# EAGLE design devboard (EAGLE 9.6.2)
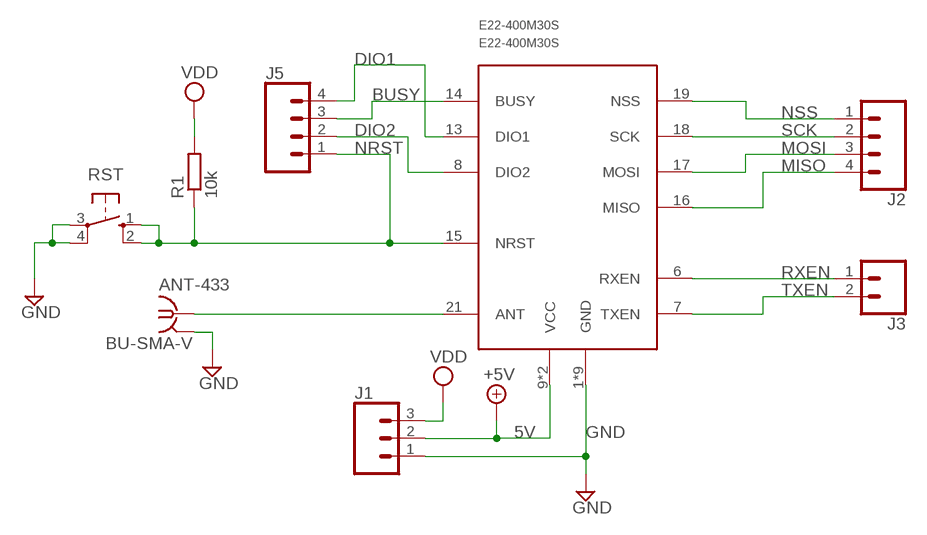
[diagram p0: schematic, sheet 1]

## Parts
ANT-433  BU-SMA-V  [BU-SMA-V]
E22-400M30S  E22-400M30S  [E22-400M30S]
J1  CONN_03LOCK_LONGPADS  [1X03_LOCK_LONGPADS]
J2  CONN_04LOCK_LONGPADS  [1X04_LOCK_LONGPADS]
J3  CONN_02PTH3  [1X02_LONGPADS]
J5  CONN_04LOCK_LONGPADS  [1X04_LOCK_LONGPADS]
R1  10k  R-EU_R0603  [R0603]
RST  10-XX  [B3F-10XX]

## Nets
5V: E22-400M30S.9(VCC) E22-400M30S.10(VCC) J1.2 ; supply symbol labelled +5V
ANT [rf433]: ANT-433.1 E22-400M30S.21(ANT)
BUSY: E22-400M30S.14(BUSY) J5.3
DIO1: E22-400M30S.13(DIO1) J5.4
DIO2: E22-400M30S.8(DIO2) J5.2
GND: ANT-433.2 ANT-433.3 ANT-433.4 ANT-433.5 E22-400M30S.1(GND) E22-400M30S.2(GND) E22-400M30S.3(GND) E22-400M30S.4(GND) E22-400M30S.5(GND) E22-400M30S.11(GND) E22-400M30S.12(GND) E22-400M30S.20(GND) E22-400M30S.22(GND) J1.1 RST.3(P) RST.4(P1)
MISO: E22-400M30S.16(MISO) J2.4
MOSI: E22-400M30S.17(MOSI) J2.3
NRST: E22-400M30S.15(NRST) J5.1 R1.1 RST.1(S) RST.2(S1)
NSS: E22-400M30S.19(NSS) J2.1
RXEN: E22-400M30S.6(RXEN) J3.1
SCK: E22-400M30S.18(SCK) J2.2
TXEN: E22-400M30S.7(TXEN) J3.2
VDD: J1.3 R1.2

## Library data of the parts
ANT-433 = conn-coax-no-thermals:BU-SMA-V: FEMALE SMA CONNECTOR Radiall distributor RS 112-3794; OC_FARNELL: unknown; OC_NEWARK: unknown
E22-400M30S = ebyte-radio:E22-400M30S: EBYTE E22400M30S radio module Datasheet and info: http://www.ebyte.com/en/product-view-news.aspx?id=454
J1 = SparkFun-Connectors:CONN_03: Multi connection point. Often used as Generic Header-pin footprint for 0.1 inch spaced/style header connections On any of the 0.1 inch spaced packages, you can populate with these: Break Away Headers - Straight <https://www.sparkfun.com/products/116> (PRT-00116) Break Away Male Headers - Right Angle <https://www.sparkfun.com/products/553> (PRT-00553) Female Headers <https://www.sparkfun.com/products/115> (PRT-00115) Break Away Headers - Machine Pin <https://www.sparkfun.com/products/117> (PRT-00117) Break Away Female Headers - Swiss Machine Pin <https://www.sparkfun.com/products/743> (PRT-00743) Stackable Header - 3 Pin (Female, 0.1") <https://www.sparkfun.com/products/13875> (PRT-13875) For SCREWTERMINALS and SPRING TERMINALS visit here: Screw Terimnals on SparkFun.com <https://www.sparkfun.com/search/results?term=Screw+Terminals> (5mm/3.5mm/2.54mm spacing) This device is also useful as a general connection point to wire up your design to another part of your project. Our various solder wires solder well into these plated through hole pads. Hook-Up Wire - Assortment (Stranded, 22 AWG) <https://www.sparkfun.com/products/11375> (PRT-11375) Hook-Up Wire - Assortment (Solid Core, 22 AWG) <https://www.sparkfun.com/products/11367> (PRT-11367) View the entire wire category on our website here <https://www.sparkfun.com/categories/141> Special notes: Molex polarized connector foot print use with SKU : PRT-08232 with associated crimp pins and housings.
J2 J5 = SparkFun-Connectors:CONN_04: Multi connection point. Often used as Generic Header-pin footprint for 0.1 inch spaced/style header connections On any of the 0.1 inch spaced packages, you can populate with these: Break Away Headers - Straight <https://www.sparkfun.com/products/116> (PRT-00116) Break Away Male Headers - Right Angle <https://www.sparkfun.com/products/553> (PRT-00553) Female Headers <https://www.sparkfun.com/products/115> (PRT-00115) Break Away Headers - Machine Pin <https://www.sparkfun.com/products/117> (PRT-00117) Break Away Female Headers - Swiss Machine Pin <https://www.sparkfun.com/products/743> (PRT-00743) For SCREWTERMINALS and SPRING TERMINALS visit here: Screw Terimnals on SparkFun.com <https://www.sparkfun.com/search/results?term=Screw+Terminals> (5mm/3.5mm/2.54mm spacing) This device is also useful as a general connection point to wire up your design to another part of your project. Our various solder wires solder well into these plated through hole pads. Hook-Up Wire - Assortment (Stranded, 22 AWG) <https://www.sparkfun.com/products/11375> (PRT-11375) Hook-Up Wire - Assortment (Solid Core, 22 AWG) <https://www.sparkfun.com/products/11367> (PRT-11367) View the entire wire category on our website here <https://www.sparkfun.com/categories/141> Special notes: Molex polarized connector foot print use with SKU : PRT-08231 with associated crimp pins and housings. 1MM SMD Version SKU: PRT-10208; PROD_ID: CONN-09696
J3 = SparkFun-Connectors:CONN_02: Multi connection point. Often used as Generic Header-pin footprint for 0.1 inch spaced/style header connections On any of the 0.1 inch spaced packages, you can populate with these: Break Away Headers - Straight <https://www.sparkfun.com/products/116> (PRT-00116) Break Away Male Headers - Right Angle <https://www.sparkfun.com/products/553> (PRT-00553) Female Headers <https://www.sparkfun.com/products/115> (PRT-00115) Break Away Headers - Machine Pin <https://www.sparkfun.com/products/117> (PRT-00117) Break Away Female Headers - Swiss Machine Pin <https://www.sparkfun.com/products/743> (PRT-00743) For SCREWTERMINALS and SPRING TERMINALS visit here: Screw Terimnals on SparkFun.com <https://www.sparkfun.com/search/results?term=Screw+Terminals> (5mm/3.5mm/2.54mm spacing) This device is also useful as a general connection point to wire up your design to another part of your project. Our various solder wires solder well into these plated through hole pads. Hook-Up Wire - Assortment (Stranded, 22 AWG) <https://www.sparkfun.com/products/11375> (PRT-11375) Hook-Up Wire - Assortment (Solid Core, 22 AWG) <https://www.sparkfun.com/products/11367> (PRT-11367) View the entire wire category on our website here <https://www.sparkfun.com/categories/141> Special notes: Molex polarized connector foot print use with: PRT-08233 with associated crimp pins and housings. 2.54_SCREWTERM for use with PRT-10571. 3.5mm Screw Terminal footprints for PRT-08084 5mm Screw Terminal footprints for use with PRT-08432
R1 = rcl:R-EU_: RESISTOR, European symbol; SPICEPREFIX: R
RST = switch-omron:10-XX: OMRON SWITCH; MPN: B3F-1000; OC_FARNELL: 176432; OC_NEWARK: 36M3542

## Net classes
0 default: clearance 0.3 mm
1 rf433: clearance 0.2 mm to class 0, clearance 0.2 mm

## Board
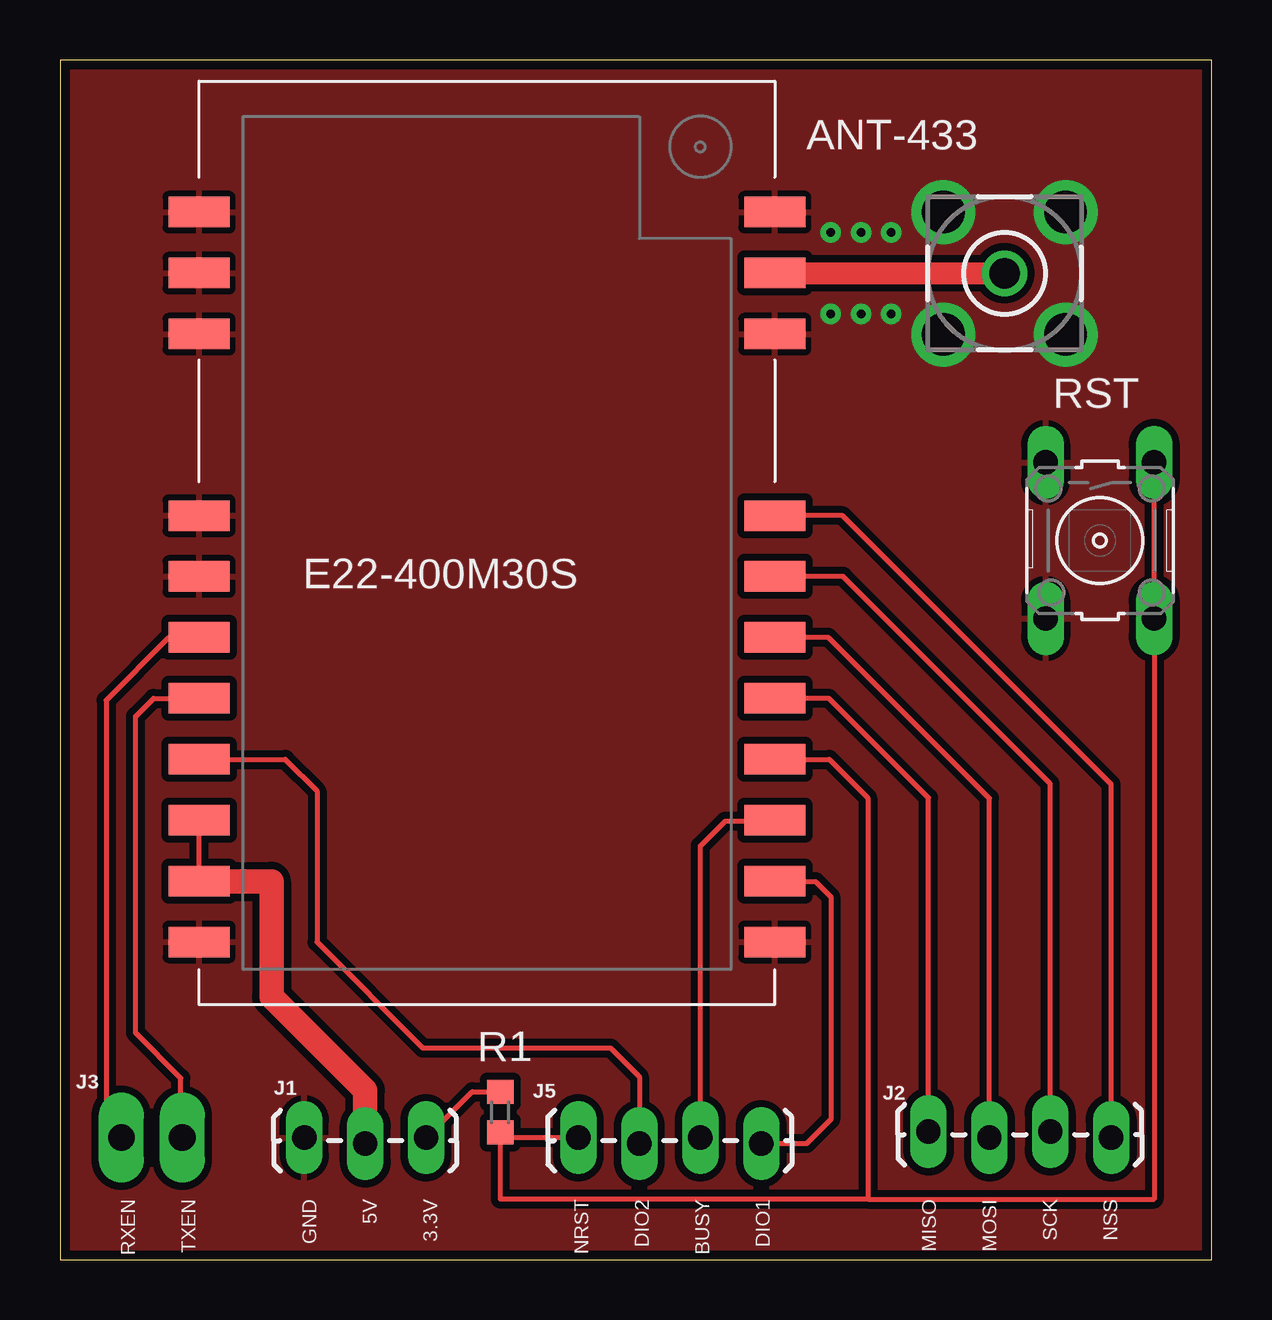
[diagram p1: board, top side]
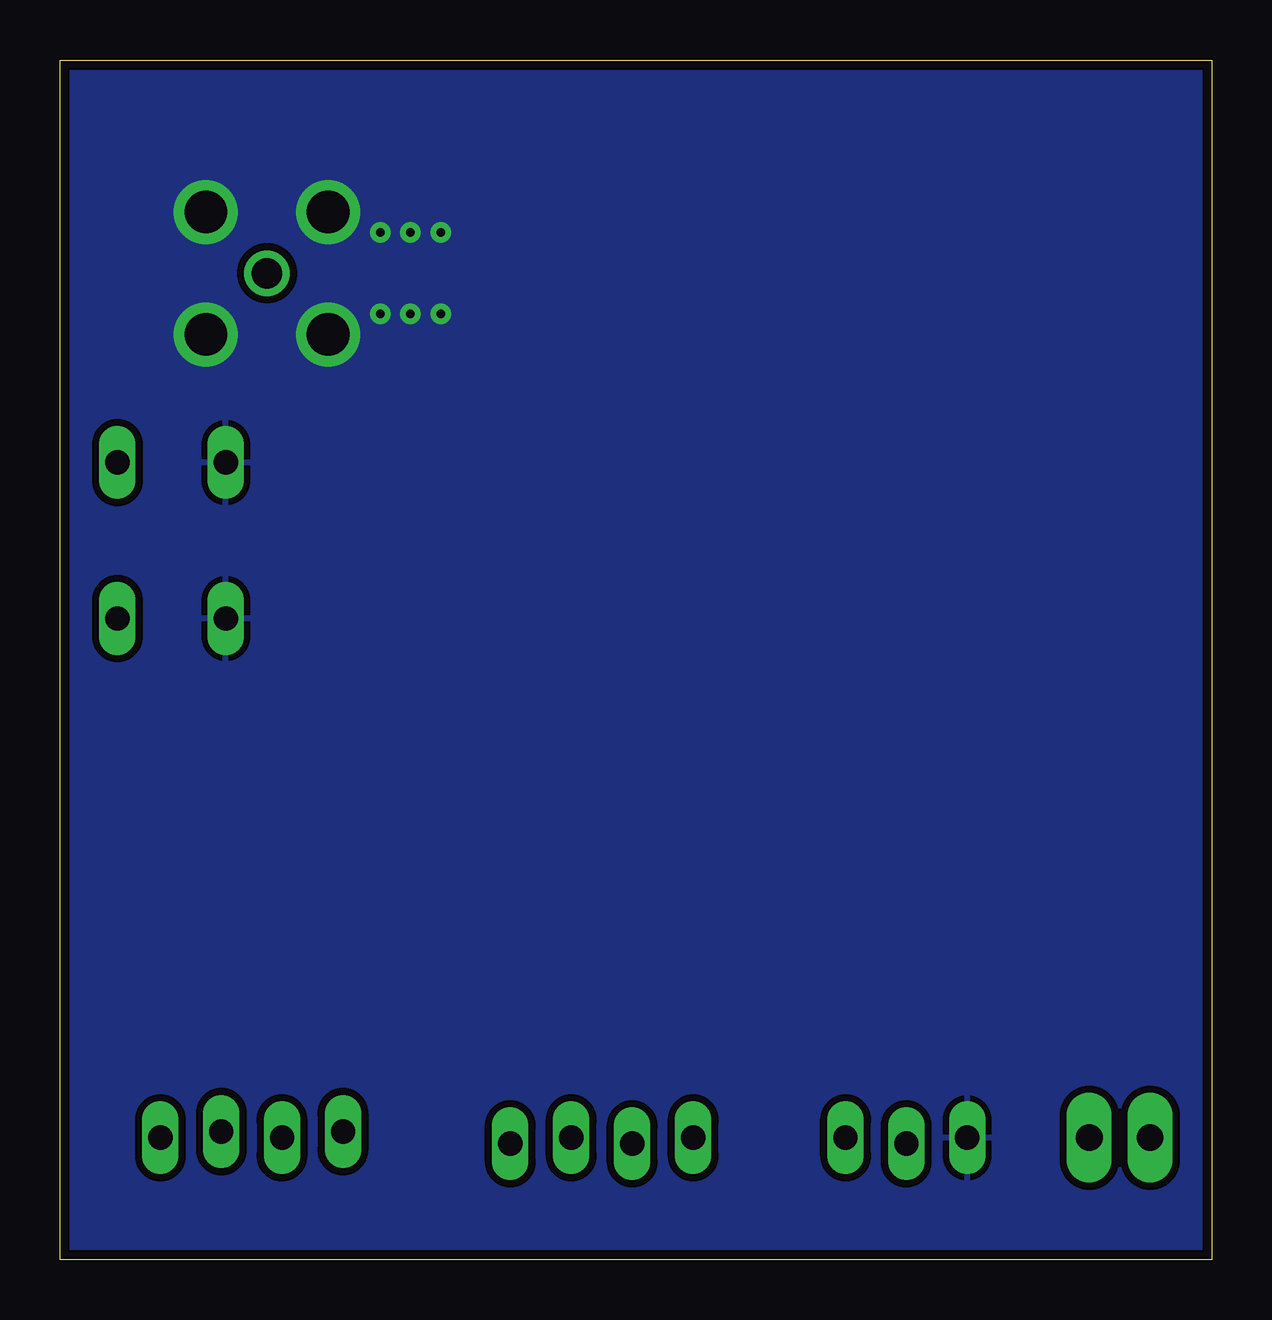
[diagram p2: board, bottom side, seen from below]

Size 48 x 50 mm. Coordinates in mm from the lower left corner, seen from the top.
Outline: 0,0 48,0 48,50 0,50 0,0
Copper layers (1*16): Top 0.035mm / dielectric 1mm / Bottom 0.035mm
Design rules "rezonit": minimum track width 0.2mm, minimum drill 0.3mm, track to track 0.25mm, track to pad 0.25mm, pad to pad 0.25mm, via to via 0.25mm, smd to smd 0.2mm, copper to edge 0.4mm, drill to drill 0.4mm, minimum pad ring 0.25mm, minimum via ring 0.25mm, stop-mask expansion 4mil, vias tented up to drill 0.6mm, thermal gap 10mil

### Footprints (pad centres in the part's own frame; a part is rotated, then mirrored left to right if it is on the bottom)
BU-SMA-V = drill 1.27: 1 0,0 | drill 1.778: 2 -2.55,2.55; 3 2.55,2.55; 4 2.55,-2.55; 5 -2.55,-2.55
E22-400M30S = smd 2.54 x 1.27: 1 12,-13.79; 2 12,-11.25; 3 12,-8.71; 4 12,-1.14; 5 12,1.4; 6 12,3.94; 7 12,6.48; 8 12,9.02; 9 12,11.56; 10 12,14.1; 11 12,16.64; 12 -12,16.64; 13 -12,14.1; 14 -12,11.56; 15 -12,9.02; 16 -12,6.48; 17 -12,3.94; 18 -12,1.4; 19 -12,-1.14; 20 -12,-8.71; 21 -12,-11.25; 22 -12,-13.79
1X03_LOCK_LONGPADS = drill 1.016 long: 1 0,0; 2 2.54,-0.254; 3 5.08,0
1X04_LOCK_LONGPADS = drill 1.016 long: 1 0,0; 2 2.54,-0.254; 3 5.08,0; 4 7.62,-0.254
1X02_LONGPADS = drill 1.118 pad 1.88 long: 1 0,0; 2 2.54,0
R0603 = smd 1 x 1.1: 1 -0.85,0; 2 0.85,0
B3F-10XX = drill 1.016 long: 1 -3.251,2.261; 2 3.251,2.261; 3 -3.251,-2.261; 4 3.251,-2.261

### Placement (x,y rotation side)
ANT-433  39.37,41.11 90 top
E22-400M30S  17.8,29.87 180 top
J1  10.18,5.08 0 top
J2  43.82,5.08 180 top
J3  2.56,5.08 0 top
J5  21.61,5.08 0 top
R1  18.35,6.15 90 top
RST  43.35,29.97 270 top

### Tracks (layer width: path | path; a pad name or v marks a point on that pad's centre or on a via)
5V
  Top 0.2: E22-400M30S.10 E22-400M30S.9
  Top 1.016: J1.2 12.72,7.05 8.82,10.95 8.82,15.77 E22-400M30S.10
ANT
  Top 0.2: ANT-433.1
  Top 0.927: E22-400M30S.21 ANT-433.1
BUSY
  Top 0.2: J5.3 26.69,17.24 27.72,18.27 29.76,18.27 E22-400M30S.14
DIO1
  Top 0.2: J5.4 31.12,4.83 32.13,5.84 32.13,15.12 31.5,15.75 29.82,15.75 E22-400M30S.13
DIO2
  Top 0.2: J5.2 24.15,7.62 22.95,8.82 15.12,8.82 10.71,13.23 10.71,19.53 9.39,20.85 E22-400M30S.8
GND  (via drill 0.35)
  other vias: 32.13,42.81 32.13,39.41 33.39,39.41 34.65,39.41 33.39,42.81 34.65,42.81
  pour Top: 0,0 0,50 48,50 48,0
  pour Bottom: 0,0 48,0 48,50 0,50
MISO
  Top 0.2: J2.4 36.2,19.24 32.05,23.39 E22-400M30S.16
MOSI
  Top 0.2: J2.3 38.74,19.22 32.03,25.93 E22-400M30S.17
NRST
  Top 0.2: J5.1 18.57,5.08 R1.1 18.35,2.53 33.67,2.53 | E22-400M30S.15 32.07,20.85 33.67,19.25 33.67,2.53 | RST.1 RST.2 45.61,2.52 33.67,2.52 33.67,2.53
NSS
  Top 0.2: J2.1 43.82,19.81 32.62,31.01 E22-400M30S.19
RXEN
  Top 0.2: J3.1 1.92,5.08 1.92,23.31 4.54,25.93 E22-400M30S.6
SCK
  Top 0.2: J2.2 41.28,19.83 32.64,28.47 E22-400M30S.18
TXEN
  Top 0.2: E22-400M30S.7 3.9,23.39 3.15,22.64 3.15,9.45 5.04,7.56 5.04,5.14 J3.2
VDD
  Top 0.2: J1.3 17.18,7 R1.2

### Text on the board
tNames: RXEN | TXEN | GND | 5V | 3.3V | NRST | DIO2 | BUSY | DIO1 | MISO | MOSI | SCK | NSS